# EAGLE design full.board.v1 (EAGLE 7.3.0)
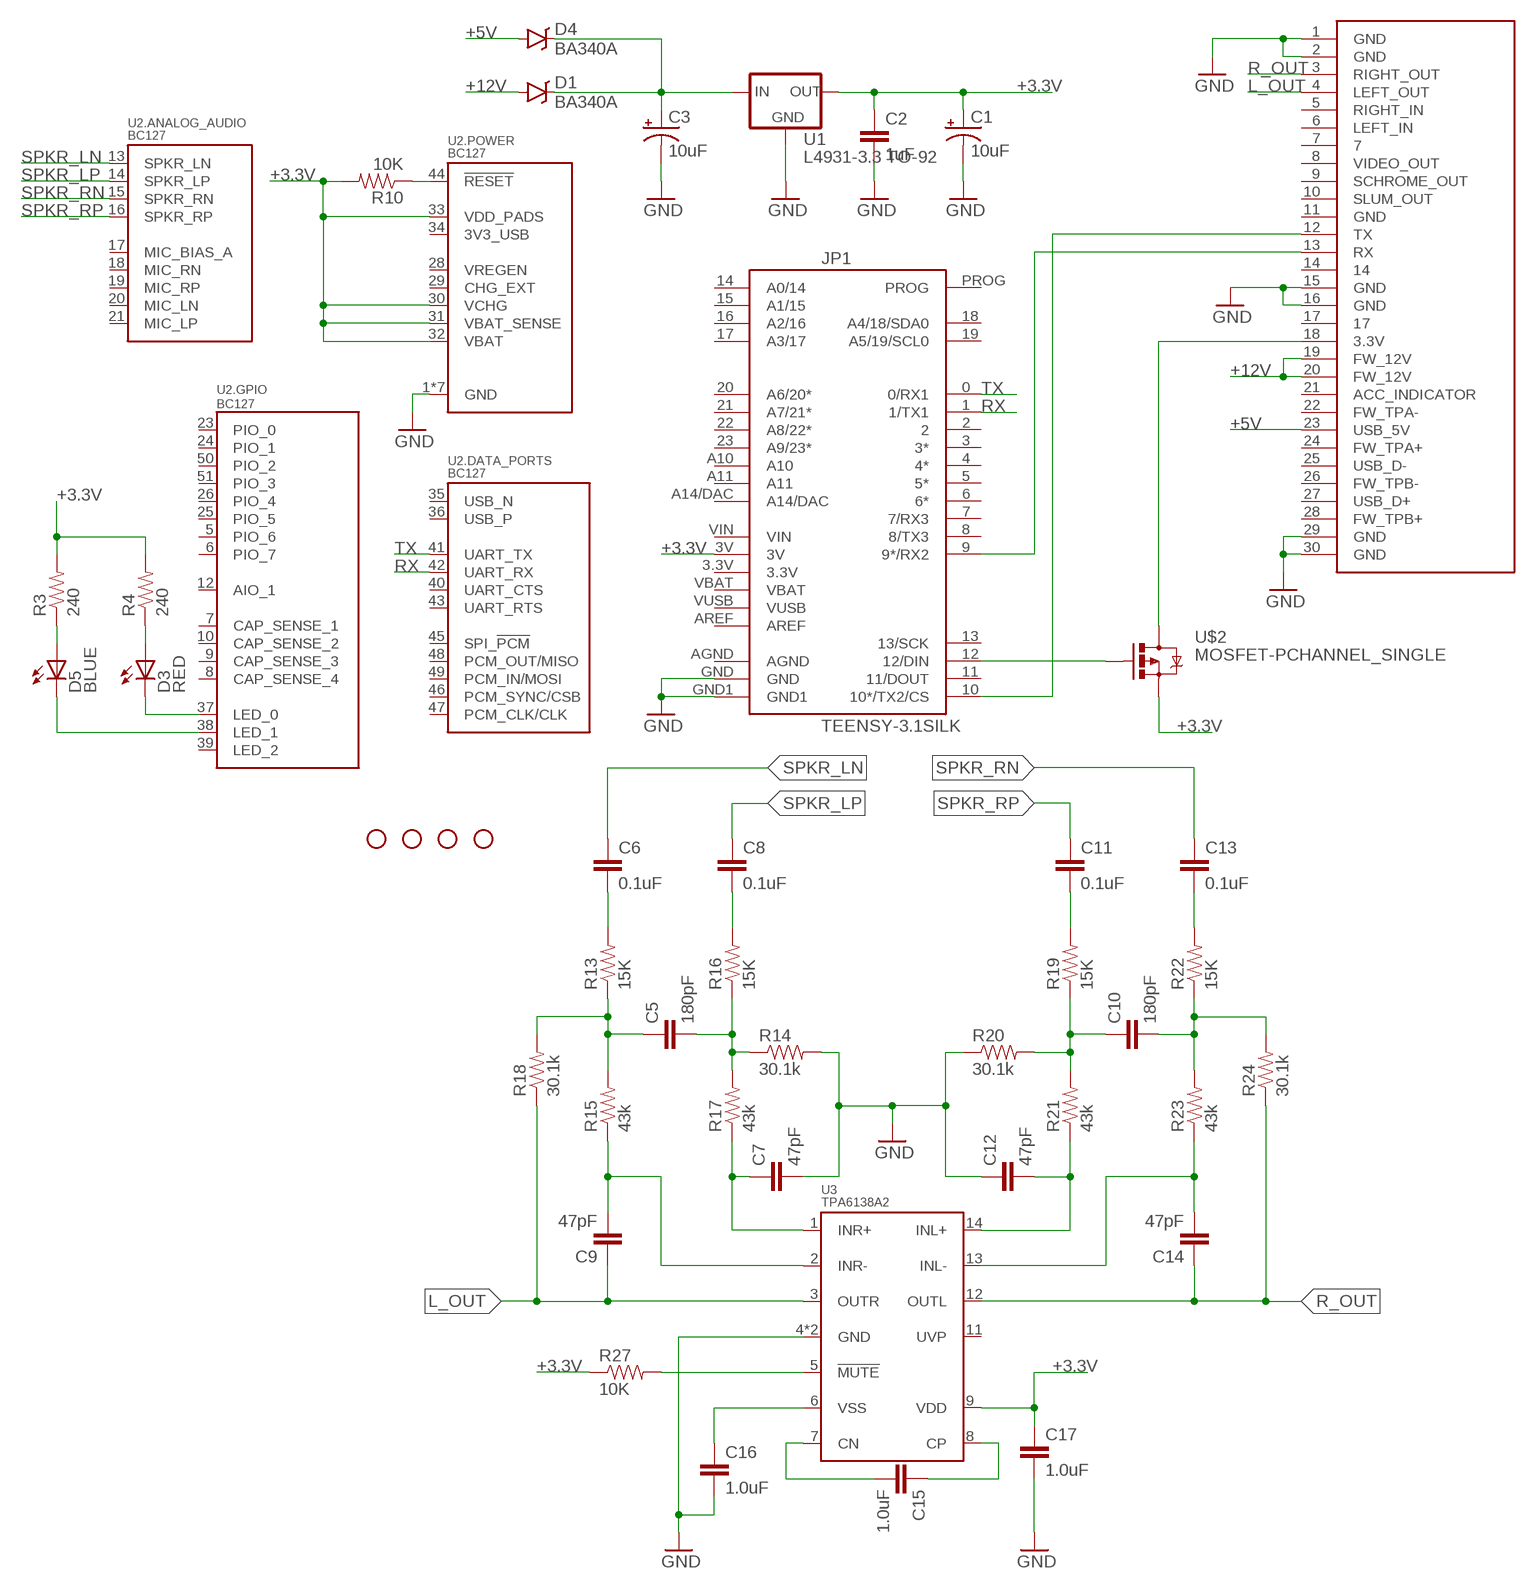
[diagram p0: schematic, sheet 1]

## Parts
C1  10uF  10UF-16V-10%(TANT)  [EIA3216]
C2  1uF  1UF-25V-10%(0805)  [0805]
C3  10uF  10UF-16V-10%(TANT)  [EIA3216]
C5  180pF  CAP0603-CAP  [0603-CAP]
C6  0.1uF  0.1UF-25V-5%(0603)  [0603-CAP]
C7  47pF  47PF-50V-5%(0603)  [0603-CAP]
C8  0.1uF  0.1UF-25V-5%(0603)  [0603-CAP]
C9  47pF  47PF-50V-5%(0603)  [0603-CAP]
C10  180pF  CAP0603-CAP  [0603-CAP]
C11  0.1uF  0.1UF-25V-5%(0603)  [0603-CAP]
C12  47pF  47PF-50V-5%(0603)  [0603-CAP]
C13  0.1uF  0.1UF-25V-5%(0603)  [0603-CAP]
C14  47pF  47PF-50V-5%(0603)  [0603-CAP]
C15  1.0uF  1.0UF-16V-10%(0603)  [0603-CAP]
C16  1.0uF  1.0UF-16V-10%(0603)  [0603-CAP]
C17  1.0uF  1.0UF-16V-10%(0603)  [0603-CAP]
D1  BA340A  B340A  [SMA-DIODE]
D3  RED  LED-RED0603  [LED-0603]
D4  BA340A  B340A  [SMA-DIODE]
D5  BLUE  LED-BLUE0603  [LED-0603]
IPOD_CONNECTOR_FEMALE  IPOD_CONNECTOR_FEMALECUTOUT  [IPOD_FEM_SM_CUTOUTS]
JP1  TEENSY-3.1SILK  [TEENSY-3.1]
R3  240  240OHM1/10W1%(0603)  [0603-RES]
R4  240  240OHM1/10W1%(0603)  [0603-RES]
R10  10K  10KOHM1/10W1%(0603)0603  [0603-RES]
R13  15K  15KOHM1/10W1%(0603)0603  [0603-RES]
R14  30.1k  30.1KOHM1/10W1%(0603)  [0603-RES]
R15  43k  43KOHM1/10W1%(0603)  [0603-RES]
R16  15K  15KOHM1/10W1%(0603)0603  [0603-RES]
R17  43k  43KOHM1/10W1%(0603)  [0603-RES]
R18  30.1k  30.1KOHM1/10W1%(0603)  [0603-RES]
R19  15K  15KOHM1/10W1%(0603)0603  [0603-RES]
R20  30.1k  30.1KOHM1/10W1%(0603)  [0603-RES]
R21  43k  43KOHM1/10W1%(0603)  [0603-RES]
R22  15K  15KOHM1/10W1%(0603)0603  [0603-RES]
R23  43k  43KOHM1/10W1%(0603)  [0603-RES]
R24  30.1k  30.1KOHM1/10W1%(0603)  [0603-RES]
R27  10K  10KOHM1/10W1%(0603)0603  [0603-RES]
STANDOFF1  STAND-OFF  [STAND-OFF]
STANDOFF2  STAND-OFF  [STAND-OFF]
STANDOFF3  STAND-OFF  [STAND-OFF]
STANDOFF4  STAND-OFF  [STAND-OFF]
U1  L4931-3.3 TO-92  V_REG_78XXTO-92_UNTESTED  [TO-92]
U2  BC127  BC127EXTRA_PASTE  [BC127_XTRA_PASTE]
U3  TPA6138A2  [TSSOP-14]
U$2  MOSFET-PCHANNEL_SINGLE  [SOT563-SINGLEFET]

## Nets
+3.3V: C1.A(+) C2.1 C17.1 JP1.3V R3.2 R4.2 R10.2 R27.1 U1.1(OUT) U2.30(.POWER:VCHG) U2.31(.POWER:VBAT_SENSE) U2.32(.POWER:VBAT) U2.33(.POWER:VDD_PADS) U3.9(VDD) U$2.S
+5V: D4.A IPOD_CONNECTOR_FEMALE.23(USB_5V)
+12V: D1.A IPOD_CONNECTOR_FEMALE.19(FW_12V) IPOD_CONNECTOR_FEMALE.20(FW_12V)
GND: C1.C(-) C2.2 C3.C(-) C7.2 C12.1 C16.2 C17.2 IPOD_CONNECTOR_FEMALE.1(GND) IPOD_CONNECTOR_FEMALE.2(GND) IPOD_CONNECTOR_FEMALE.15(GND) IPOD_CONNECTOR_FEMALE.16(GND) IPOD_CONNECTOR_FEMALE.29(GND) IPOD_CONNECTOR_FEMALE.30(GND) JP1.GND JP1.GND1 R14.2 R20.1 U1.2(GND) U2.1(.POWER:GND) U2.2(.POWER:GND) U2.3(.POWER:GND) U2.4(.POWER:GND) U2.11(.POWER:GND) U2.22(.POWER:GND) U2.27(.POWER:GND) U3.4(GND) U3.10(GND)
L_OUT: C9.1 IPOD_CONNECTOR_FEMALE.4(LEFT_OUT) R18.1 U3.3(OUTR)
LED_0: D3.C U2.37(.GPIO:LED_0)
LED_1: D5.C U2.38(.GPIO:LED_1)
N$1: C3.A(+) D1.C D4.C U1.3(IN)
N$2: IPOD_CONNECTOR_FEMALE.13(RX) JP1.9(9*/RX2)
N$3: IPOD_CONNECTOR_FEMALE.12(TX) JP1.10(10*/TX2/CS)
N$4: R10.1 U2.44(.POWER:!RESET)
N$5: C8.2 R16.2
N$6: C6.2 R13.2
N$7: R27.2 U3.5(!MUTE)
N$8: C5.1 R13.1 R15.2 R18.2
N$9: C9.2 R15.1 U3.2(INR-)
N$10: JP1.12(12/DIN) U$2.G
N$11: D5.A R3.1
N$12: C7.1 R17.1 U3.1(INR+)
N$13: C5.2 R14.1 R16.1 R17.2
N$14: D3.A R4.1
N$15: IPOD_CONNECTOR_FEMALE.18(3.3V) U$2.D1(D) U$2.D2(D) U$2.D3(D) U$2.D4(D)
N$16: C10.1 R19.1 R20.2 R21.2
N$17: C12.2 R21.1 U3.14(INL+)
N$18: C11.2 R19.2
N$19: C10.2 R22.1 R23.2 R24.2
N$20: C13.2 R22.2
N$21: C14.2 R23.1 U3.13(INL-)
N$24: C16.1 U3.6(VSS)
N$25: C15.2 U3.7(CN)
N$26: C15.1 U3.8(CP)
R_OUT: C14.1 IPOD_CONNECTOR_FEMALE.3(RIGHT_OUT) R24.1 U3.12(OUTL)
RX: JP1.1(1/TX1) U2.42(.DATA_PORTS:UART_RX)
SPKR_LN: C6.1 U2.13(.ANALOG_AUDIO:SPKR_LN)
SPKR_LP: C8.1 U2.14(.ANALOG_AUDIO:SPKR_LP)
SPKR_RN: C13.1 U2.15(.ANALOG_AUDIO:SPKR_RN)
SPKR_RP: C11.1 U2.16(.ANALOG_AUDIO:SPKR_RP)
TX: JP1.0(0/RX1) U2.41(.DATA_PORTS:UART_TX)
Unconnected: IPOD_CONNECTOR_FEMALE.5(RIGHT_IN) IPOD_CONNECTOR_FEMALE.6(LEFT_IN) IPOD_CONNECTOR_FEMALE.7 IPOD_CONNECTOR_FEMALE.8(VIDEO_OUT) IPOD_CONNECTOR_FEMALE.9(SCHROME_OUT) IPOD_CONNECTOR_FEMALE.10(SLUM_OUT) IPOD_CONNECTOR_FEMALE.11(GND) IPOD_CONNECTOR_FEMALE.14 IPOD_CONNECTOR_FEMALE.17 IPOD_CONNECTOR_FEMALE.21(ACC_INDICATOR) IPOD_CONNECTOR_FEMALE.22(FW_TPA-) IPOD_CONNECTOR_FEMALE.24(FW_TPA+) IPOD_CONNECTOR_FEMALE.25(USB_D-) IPOD_CONNECTOR_FEMALE.26(FW_TPB-) IPOD_CONNECTOR_FEMALE.27(USB_D+) IPOD_CONNECTOR_FEMALE.28(FW_TPB+) JP1.2 JP1.3(3*) JP1.3.3V JP1.4(4*) JP1.5(5*) JP1.6(6*) JP1.7(7/RX3) JP1.8(8/TX3) JP1.11(11/DOUT) JP1.13(13/SCK) JP1.14(A0/14) JP1.15(A1/15) JP1.16(A2/16) JP1.17(A3/17) JP1.18(A4/18/SDA0) JP1.19(A5/19/SCL0) JP1.20(A6/20*) JP1.21(A7/21*) JP1.22(A8/22*) JP1.23(A9/23*) JP1.A10 JP1.A11 JP1.A14/DAC JP1.AGND JP1.AREF JP1.PROG JP1.VBAT JP1.VIN JP1.VUSB U2.5(.GPIO:PIO_6) U2.6(.GPIO:PIO_7) U2.7(.GPIO:CAP_SENSE_1) U2.8(.GPIO:CAP_SENSE_4) U2.9(.GPIO:CAP_SENSE_3) U2.10(.GPIO:CAP_SENSE_2) U2.12(.GPIO:AIO_1) U2.17(.ANALOG_AUDIO:MIC_BIAS_A) U2.18(.ANALOG_AUDIO:MIC_RN) U2.19(.ANALOG_AUDIO:MIC_RP) U2.20(.ANALOG_AUDIO:MIC_LN) U2.21(.ANALOG_AUDIO:MIC_LP) U2.23(.GPIO:PIO_0) U2.24(.GPIO:PIO_1) U2.25(.GPIO:PIO_5) U2.26(.GPIO:PIO_4) U2.28(.POWER:VREGEN) U2.29(.POWER:CHG_EXT) U2.34(.POWER:3V3_USB) U2.35(.DATA_PORTS:USB_N) U2.36(.DATA_PORTS:USB_P) U2.39(.GPIO:LED_2) U2.40(.DATA_PORTS:UART_CTS) U2.43(.DATA_PORTS:UART_RTS) U2.45(.DATA_PORTS:SPI_!PCM) U2.46(.DATA_PORTS:PCM_SYNC/CSB) U2.47(.DATA_PORTS:PCM_CLK/CLK) U2.48(.DATA_PORTS:PCM_OUT/MISO) U2.49(.DATA_PORTS:PCM_IN/MOSI) U2.50(.GPIO:PIO_2) U2.51(.GPIO:PIO_3) U3.11(UVP)

## Library data of the parts
C1 C3 = SparkFun-Capacitors:10UF-16V-10%(TANT): CAP-00811 1206/EIA-3216 Tantalum capacitor; PROD_ID: CAP-00811
C2 = SparkFun-Capacitors:1UF-25V-10%(0805): CAP-08064; PROD_ID: CAP-08064
C5 C10 = SparkFun-Capacitors:CAP: Capacitor Standard 0603 ceramic capacitor, and 0.1" leaded capacitor.; DIST: Digikey; DIST_ID: 1276-1255-2-ND
C6 C8 C11 C13 = SparkFun-Capacitors:0.1UF-25V-5%(0603): CAP-08604; PROD_ID: CAP-08604
C7 C9 C12 C14 = SparkFun-Capacitors:47PF-50V-5%(0603): CAP-08913; PROD_ID: CAP-08913
C15-C17 = SparkFun-Capacitors:1.0UF-16V-10%(0603): CAP-00868; PROD_ID: CAP-00868
D1 D4 = SparkFun-DiscreteSemi:B340A: Schottky Diode 3A-40V; PROD_ID: DIO-09886
D3 = SparkFun-LED:LED-RED: Assorted Red LEDs LilyPad 1206- DIO-09912 1206- DIO-00809 0603- DIO-00819; PROD_ID: DIO-00819
D5 = SparkFun-LED:LED-BLUE: Blue LEDs for production use Various blue LEDs stocked by SparkFun production 0603 - DIO-08575 Rebel - DIO-09553 1206 - DIO-09911; PROD_ID: DIO-08575
IPOD_CONNECTOR_FEMALE = SparkFun-Connectors:IPOD_CONNECTOR_FEMALE: iPod Female Connector This is the connector found inside current iPods. Use this connector to attach to iPod accessories like Nike+iPods, etc. Schematic and footprint are not yet production proven. Spark Fun Electronics SKU : DEV-08035
JP1 = SparkFun-Boards:TEENSY-3.1; SF_ID: DEV-12646
R3 R4 = SparkFun-Resistors:240OHM1/10W1%(0603): RES-07849; PROD_ID: RES-07849
R10 R27 = SparkFun-Resistors:10KOHM1/10W1%(0603): RES-00824; PROD_ID: RES-00824
R13 R16 R19 R22 = SparkFun-Resistors:15KOHM1/10W1%(0603): RES-07854; PROD_ID: RES-07854
R14 R18 R20 R24 = SparkFun-Resistors:30.1KOHM1/10W1%(0603): RES-08595; PROD_ID: RES-08595
R15 R17 R21 R23 = SparkFun-Resistors:43KOHM1/10W1%(0603): RES-07858; PROD_ID: RES-07858
STANDOFF1-STANDOFF4 = SparkFun-Electromechanical:STAND-OFF: #4 Stand Off This is the mechanical footprint for a #4 phillips button head screw. Use the keepout ring to avoid running the screw head into surrounding components. SKU : PRT-00447
U1 = SparkFun-PowerIC:V_REG_78XX: Voltage Regulator Standard 78xx regulator. IGO (Input Ground Output). Spark Fun Electronics SKU : COM-00107
U2 = SparkFun-RF:BC127: Blue Creations BC127 BLE module Hyper-competent Bluetooth 4.0 module, with: - Pre-4.0 support - 4 Cap sense inputs - 1 Analog input - 8 GPIO - 3 Open-drain LED drivers - Onboard battery charge circuitry - SPP/UART support - PCM Audio support - SPI port - Built-in USB - All kinds of other crazy crap
U3 = SparkFun-AnalogIC:TPA6138A2: Headphone driver amp Differential to single-ended audio amplifier.; PROD_ID: IC-11779
U$2 = SparkFun-DiscreteSemi:MOSFET-PCHANNEL_SINGLE

## Board
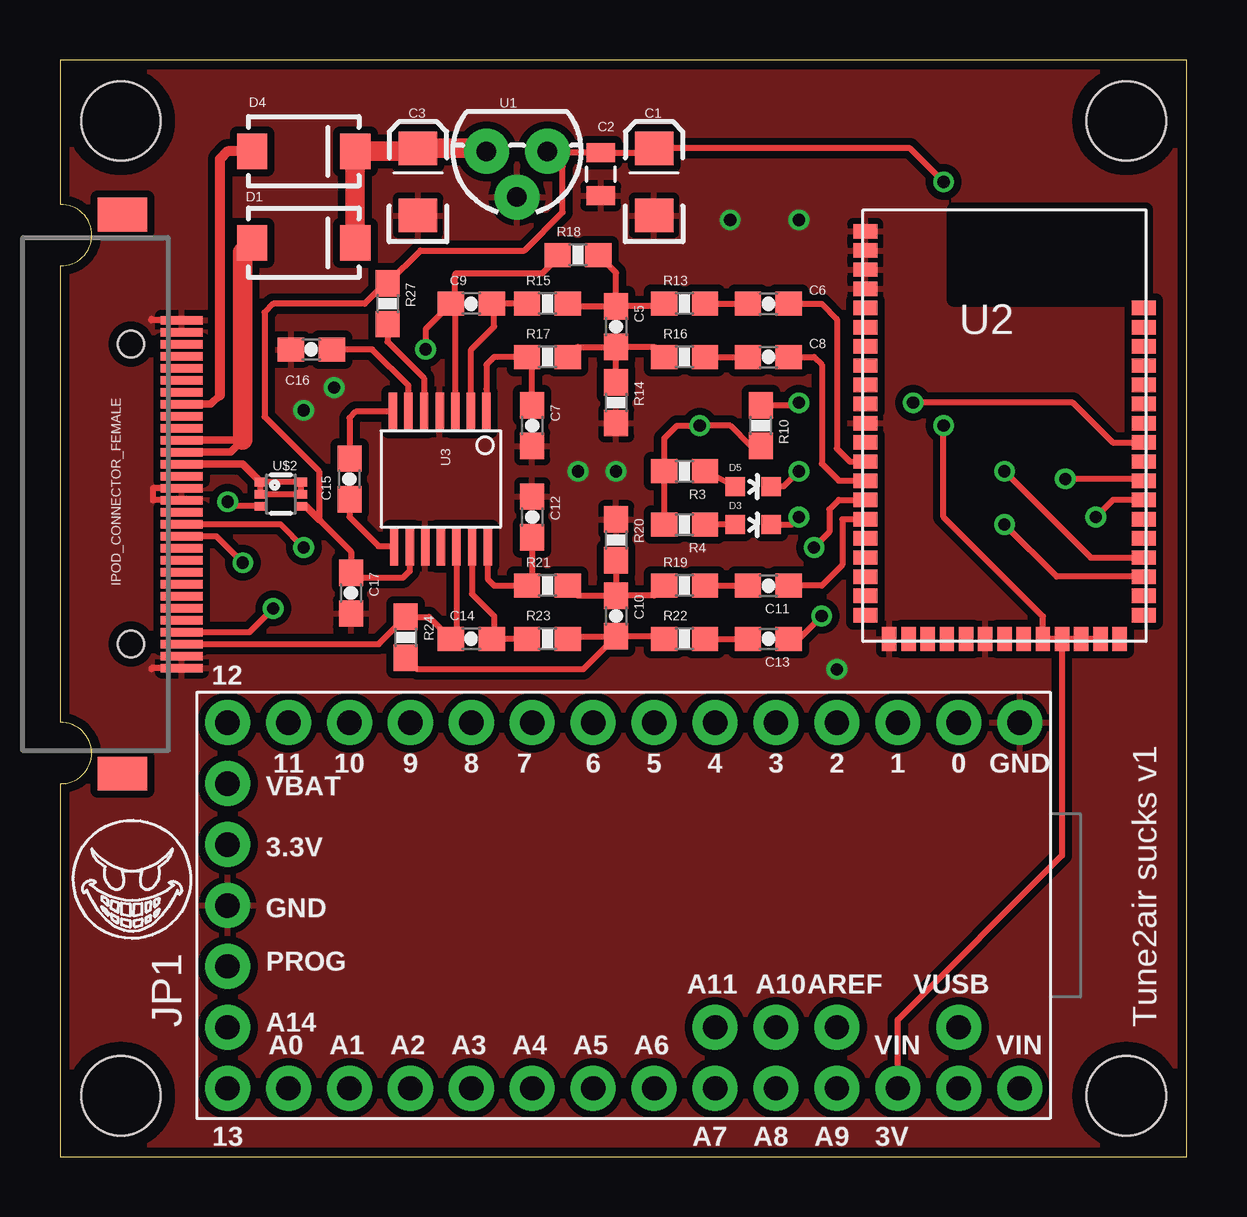
[diagram p1: board, top side]
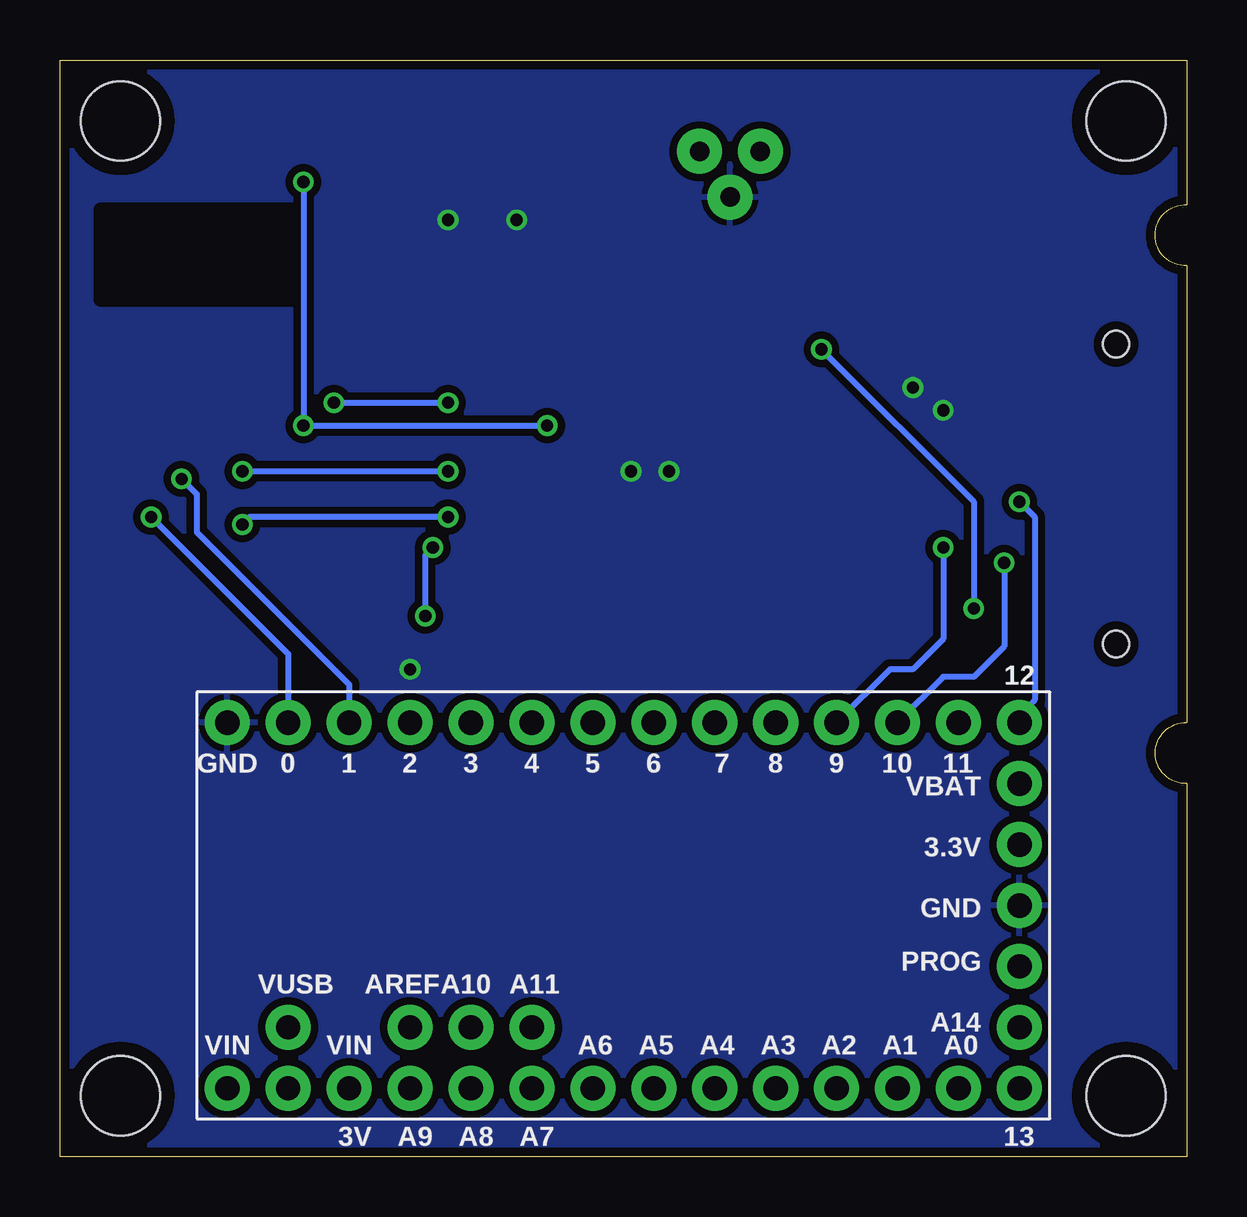
[diagram p2: board, bottom side, seen from below]

Size 46.98 x 45.72 mm. Coordinates in mm from the lower left corner, seen from the top.
Outline: 0,45.71 46.98,45.71 46.98,0 0,0 0,15.56
Outline: 0,45.72 0,39.69
Outline: 0,37.15 0,18.1
Copper layers (1*16): Top 0.0356mm / dielectric 1.5011mm / Bottom 0.0356mm
Design rules "oshpark-2layer *": minimum track width 6mil, minimum drill 13mil, track to track 6mil, track to pad 6mil, pad to pad 6mil, via to via 6mil, smd to smd 6mil, copper to edge 15mil, drill to drill 6mil, minimum pad ring 7mil, minimum via ring 7mil, stop-mask expansion 4mil, vias tented up to drill 20mil, thermal gap 10mil

### Footprints (pad centres in the part's own frame; a part is rotated, then mirrored left to right if it is on the bottom)
EIA3216 = smd 1.4 x 1.6: A 1.4,0; C -1.4,0
0805 = smd 0.8 x 1.2: 1 -0.9,0; 2 0.9,0
0603-CAP = smd 1.1 x 1: 1 -0.85,0; 2 0.85,0
SMA-DIODE = smd 1.27 x 1.47: A -2.15,0; C 2.15,0
LED-0603 = smd 0.8 x 0.8: A 0,-0.75; C 0,0.75
IPOD_FEM_SM_CUTOUTS = smd 0.35 x 1.75: 1 -7.25,0; 2 -6.75,0; 3 -6.25,0; 4 -5.75,0; 5 -5.25,0; 6 -4.75,0; 7 -4.25,0; 8 -3.75,0; 9 -3.25,0; 10 -2.75,0; 11 -2.25,0; 12 -1.75,0; 13 -1.25,0; 14 -0.75,0; 15 -0.25,0; 16 0.25,0; 17 0.75,0; 18 1.25,0; 19 1.75,0; 20 2.25,0; 21 2.75,0; 22 3.25,0; 23 3.75,0; 24 4.25,0; 25 4.75,0; 26 5.25,0; 27 5.75,0; 28 6.25,0; 29 6.75,0; 30 7.25,0 | smd 1.4 x 2.05: 31 -11.65,2.475; 32 11.65,2.475 | hole 1.1: 6.25,2.125; -6.25,2.125
TEENSY-3.1 = drill 1.016 pad 1.88: 0 16.51,3.81; 1 16.51,6.35; 2 16.51,8.89; 3 16.51,11.43; 3.3V 11.43,34.29; 3V 1.27,6.35; 4 16.51,13.97; 5 16.51,16.51; 6 16.51,19.05; 7 16.51,21.59; 8 16.51,24.13; 9 16.51,26.67; 10 16.51,29.21; 11 16.51,31.75; 12 16.51,34.29; 13 1.27,34.29; 14 1.27,31.75; 15 1.27,29.21; 16 1.27,26.67; 17 1.27,24.13; 18 1.27,21.59; 19 1.27,19.05; 20 1.27,16.51; 21 1.27,13.97; 22 1.27,11.43; 23 1.27,8.89; A10 3.81,11.43; A11 3.81,13.97; A14/DAC 3.81,34.29; AGND 1.27,3.81; AREF 3.81,8.89; GND 8.89,34.29; GND1 16.51,1.27; PROG 6.35,34.29; VBAT 13.97,34.29; VIN 1.27,1.27; VUSB 3.81,3.81
0603-RES = smd 1.1 x 1: 1 -0.85,0; 2 0.85,0
STAND-OFF = hole 3.302: 0,0
TO-92 = drill 0.813 pad 1.88: 1 -1.27,0; 2 0,1.905; 3 1.27,0
BC127_XTRA_PASTE = smd 1 x 0.6: 1 -5.8,8.1; 2 -5.8,7.3; 3 -5.8,6.5; 4 -5.8,5.7; 5 -5.8,4.9; 6 -5.8,4.1; 7 -5.8,3.3; 8 -5.8,2.5; 9 -5.8,1.7; 10 -5.8,0.9; 11 -5.8,0.1; 12 -5.8,-0.7; 13 -5.8,-1.5; 14 -5.8,-2.3; 15 -5.8,-3.1; 16 -5.8,-3.9; 17 -5.8,-4.7; 18 -5.8,-5.5; 19 -5.8,-6.3; 20 -5.8,-7.1; 21 -5.8,-7.9; 35 5.8,-7.9; 36 5.8,-7.1; 37 5.8,-6.3; 38 5.8,-5.5; 39 5.8,-4.7; 40 5.8,-3.9; 41 5.8,-3.1; 42 5.8,-2.3; 43 5.8,-1.5; 44 5.8,-0.7; 45 5.8,0.1; 46 5.8,0.9; 47 5.8,1.7; 48 5.8,2.5; 49 5.8,3.3; 50 5.8,4.1; 51 5.8,4.9 | smd 0.6 x 1: 22 -4.8,-8.9; 23 -4,-8.9; 24 -3.2,-8.9; 25 -2.4,-8.9; 26 -1.6,-8.9; 27 -0.8,-8.9; 28 0,-8.9; 29 0.8,-8.9; 30 1.6,-8.9; 31 2.4,-8.9; 32 3.2,-8.9; 33 4,-8.9; 34 4.8,-8.9
TSSOP-14 = smd 1.6 x 0.35: 1 -2.8,1.9; 2 -2.8,1.25; 3 -2.8,0.6; 4 -2.8,-0.05; 5 -2.8,-0.7; 6 -2.8,-1.35; 7 -2.8,-2; 8 2.8,-1.95; 9 2.8,-1.3; 10 2.8,-0.65; 11 2.8,0; 12 2.8,0.65; 13 2.8,1.3; 14 2.8,1.95
SOT563-SINGLEFET = smd 0.375 x 0.5: D1 -0.5,0.85; D3 -0.5,-0.85 | smd 0.35 x 0.5: D2 0,0.85; D4 0,-0.85; G 0.5,-0.85; S 0.5,0.85

### Placement (x,y rotation side)
C1  24.77,40.64 90 top
C2  22.54,40.96 270 top
C3  14.92,40.64 90 top
C5  23.18,34.61 270 top
C6  29.53,35.56 180 top
C7  19.68,30.48 270 top
C8  29.53,33.34 180 top
C9  17.14,35.56 0 top
C10  23.18,22.54 270 top
C11  29.53,23.81 180 top
C12  19.68,26.67 270 top
C13  29.53,21.59 180 top
C14  17.14,21.59 0 top
C15  12.06,28.26 90 top
C16  10.48,33.66 180 top
C17  12.13,23.5 270 top
D1  10.16,38.1 0 top
D3  28.89,26.35 270 top
D4  10.16,41.91 0 top
D5  28.89,27.94 270 top
IPOD_CONNECTOR_FEMALE  5.08,27.62 90 top
JP1  41.27,1.59 90 top
R3  26.04,28.57 180 top
R4  26.04,26.35 180 top
R10  29.21,30.48 270 top
R13  26.04,35.56 0 top
R14  23.18,31.43 270 top
R15  20.32,35.56 0 top
R16  26.04,33.34 0 top
R17  20.32,33.34 0 top
R18  21.59,37.59 0 top
R19  26.04,23.81 0 top
R20  23.18,25.72 270 top
R21  20.32,23.81 0 top
R22  26.04,21.59 0 top
R23  20.32,21.59 0 top
R24  14.41,21.65 270 top
R27  13.65,35.56 270 top
STANDOFF1  44.45,2.54 0 top
STANDOFF2  44.45,43.18 0 top
STANDOFF3  2.54,43.18 0 top
STANDOFF4  2.54,2.54 0 top
U1  19.05,41.91 180 top
U2  39.37,30.48 0 top
U3  15.88,28.26 270 top
U$1  [EVIL_SMILEY_LOGO]  0.24,8.81 0 top
U$2  9.21,27.62 270 top

### Tracks (layer width: path | path; a pad name or v marks a point on that pad's centre or on a via)
+3.3V  (via drill 0.51)
  Top 0.254: U2.33 U2.32 U2.31 | U2.31 U2.30 40.97,22.53 36.83,26.67 v36.83,30.48 | R4.2 R3.2 25.18,29.95 25.72,30.48 v26.67,30.48 27.94,30.48 28.79,29.63 R10.2 | U3.9 14.57,24.42 14.29,24.13 12.34,24.13 C17.1 12.13,25.23 10.79,26.57 10.79,28.57 8.52,30.85 8.52,35.19 8.89,35.56 12.7,35.56 13.55,36.41 R27.1 15.03,37.78 19.37,37.78 20.95,39.37 20.95,41.27 U1.1 20.32,41.86 C2.1 24.58,41.86 C1.A 35.43,42.04 v36.83,40.64 | JP1.3V 34.92,5.71 41.77,12.56 U2.31
  Top 0.305: 10.79,26.57 10.24,27.12 U$2.S
  Bottom 0.254: v26.67,30.48 v36.83,30.48 v36.83,40.64
+5V
  Top 0.305: IPOD_CONNECTOR_FEMALE.23 6.29,31.37 6.67,31.75
  Top 0.406: D4.A 6.99,41.91 6.67,41.59 6.67,31.75
+12V
  Top 0.305: IPOD_CONNECTOR_FEMALE.20 7.62,29.87 7.12,29.37 IPOD_CONNECTOR_FEMALE.19
  Top 0.813: 7.62,29.87 7.62,37.71 D1.A
GND  (via drill 0.51)
  Top 0.254: IPOD_CONNECTOR_FEMALE.16 3.88,27.87 3.88,27.37 IPOD_CONNECTOR_FEMALE.15 | IPOD_CONNECTOR_FEMALE.30 3.81,34.87 3.81,34.92 | IPOD_CONNECTOR_FEMALE.1 3.81,20.37 3.81,20.32
  other vias: 10.16,31.11 21.59,28.57 30.8,39.05 27.94,39.05 23.18,28.57 32.38,20.32 11.43,32.07
  pour Top (isolate 0.305): 0,45.72 46.99,45.72 46.99,0 0,0
  pour Bottom (isolate 0.305): 0,45.72 46.99,45.72 46.99,0 0,0
L_OUT  (via drill 0.51)
  Top 0.254: 16.48,35.38 C9.1 15.24,34.51 v15.24,33.66 | 16.48,35.38 U3.3 | IPOD_CONNECTOR_FEMALE.4 7.9,21.87 v8.89,22.86 | 16.48,35.38 16.48,36.8 16.51,36.83 20.11,36.83 20.74,37.47 R18.1
  Bottom 0.254: v15.24,33.66 8.89,27.3 v8.89,22.86
LED_0  (via drill 0.51)
  Top 0.254: U2.37 41.54,24.18 v39.37,26.35 | D3.C 30.48,26.35 v30.8,26.67
  Bottom 0.254: v30.8,26.67 39.05,26.67 v39.37,26.35
LED_1  (via drill 0.51)
  Top 0.254: v39.37,28.57 42.97,24.98 U2.38 | v30.8,28.57 30.16,27.94 D5.C
  Bottom 0.254: v39.37,28.57 v30.8,28.57
N$1
  Top 0.813: D1.C D4.C 14.47,41.91 C3.A 17.65,42.04 U1.3
N$2  (via drill 0.51)
  Top 0.254: IPOD_CONNECTOR_FEMALE.13 9.19,26.37 v10.16,25.4
  Bottom 0.254: v10.16,25.4 10.16,21.59 11.43,20.32 12.38,20.32 JP1.9
N$3  (via drill 0.51)
  Top 0.254: IPOD_CONNECTOR_FEMALE.12 6.51,25.87 v7.62,24.77
  Bottom 0.254: JP1.10 10.16,20 8.89,20 7.62,21.27 v7.62,24.77
N$4  (via drill 0.51)
  Top 0.254: R10.1 30.7,31.33 v30.8,31.43 | U2.44 43.88,29.78 42.23,31.43 v35.56,31.43
  Bottom 0.254: v35.56,31.43 v30.8,31.43
N$5
  Top 0.254: R16.2 C8.2
N$6
  Top 0.254: R13.2 C6.2
N$7
  Top 0.254: R27.2 13.65,33.97 15.18,32.45 U3.5
N$8
  Top 0.254: R13.1 25.08,35.46 C5.1 | R15.2 21.27,35.46 C5.1 | C5.1 23.18,36.85 R18.2
N$9
  Top 0.254: R15.1 C9.2 18.1,35.46 18.1,34.61 17.14,33.66 17.14,30.8 17.12,30.82 U3.2
N$10  (via drill 0.51)
  Top 0.254: U$2.G 7.17,27.12 v6.99,27.3
  Bottom 0.254: v6.99,27.3 6.35,26.67 6.35,19.05 6.99,18.41 JP1.12
N$11
  Top 0.254: D5.A R3.1
N$12
  Top 0.254: U3.1 17.78,32.02 17.78,33.02 18.1,33.34 R17.1 19.68,33.12 C7.1
N$13
  Top 0.254: R14.1 C5.2 | R16.1 24.77,33.76 C5.2 | R17.2 21.59,33.76 C5.2
N$14
  Top 0.254: D3.A R4.1
N$15
  Top 0.254: U$2.D3 U$2.D4 U$2.D2 U$2.D1 U$2.D3 | U$2.D3 8.26,28.12
  Top 0.305: IPOD_CONNECTOR_FEMALE.18 7.61,28.87 U$2.D3
N$16
  Top 0.254: R19.1 24.77,23.39 C10.1 | R21.2 21.59,23.39 C10.1 | R20.2 C10.1
N$17
  Top 0.254: U3.14 17.82,24.09 18.1,23.81 R21.1 19.68,24.03 C12.2
N$18
  Top 0.254: R19.2 C11.2
N$19
  Top 0.254: R22.1 25.08,21.69 C10.2 | R23.2 21.27,21.69 C10.2 | C10.2 21.8,20.32 14.9,20.32 R24.2
N$20
  Top 0.254: R22.2 C13.2
N$21
  Top 0.254: U3.13 17.18,23.46 18.1,22.54 18.1,21.69 C14.2 R23.1
N$24
  Top 0.254: U3.6 14.53,32.15 13.02,33.66 C16.1
N$25
  Top 0.254: U3.7 12.32,31.06 12.06,30.8 C15.2
N$26
  Top 0.254: C15.1 12.06,26.67 13.28,25.46 U3.8
R_OUT
  Top 0.254: U3.12 16.52,21.82 C14.1 | 16.51,21.38 C14.1 | C14.1 15.38,22.5 R24.1 13.28,21.37 IPOD_CONNECTOR_FEMALE.3
RX  (via drill 0.51)
  Top 0.254: U2.42 45.09,28.26 v41.91,28.26
  Bottom 0.254: JP1.1 34.92,19.68 41.27,26.04 41.27,27.62 v41.91,28.26
SPKR_LN
  Top 0.254: C6.1 31.75,35.56 32.38,34.92 32.38,29.53 32.93,28.98 U2.13
SPKR_LP
  Top 0.254: C8.1 31.43,33.34 31.75,33.02 31.75,28.89 32.46,28.18 U2.14
SPKR_RN  (via drill 0.51)
  Top 0.254: v31.75,22.54 30.8,21.59 C13.1 | v31.43,25.4 32.07,26.04 32.07,26.99 32.46,27.38 U2.15
  Bottom 0.254: v31.43,25.4 31.75,25.08 v31.75,22.54
SPKR_RP
  Top 0.254: U2.16 32.61,26.58 32.61,24.68 31.75,23.81 C11.1
TX  (via drill 0.51)
  Top 0.254: U2.41 43.89,27.38 v43.18,26.67
  Bottom 0.254: v43.18,26.67 37.47,20.95 JP1.0

### Text on the board
tPlace: Tune2air sucks v1